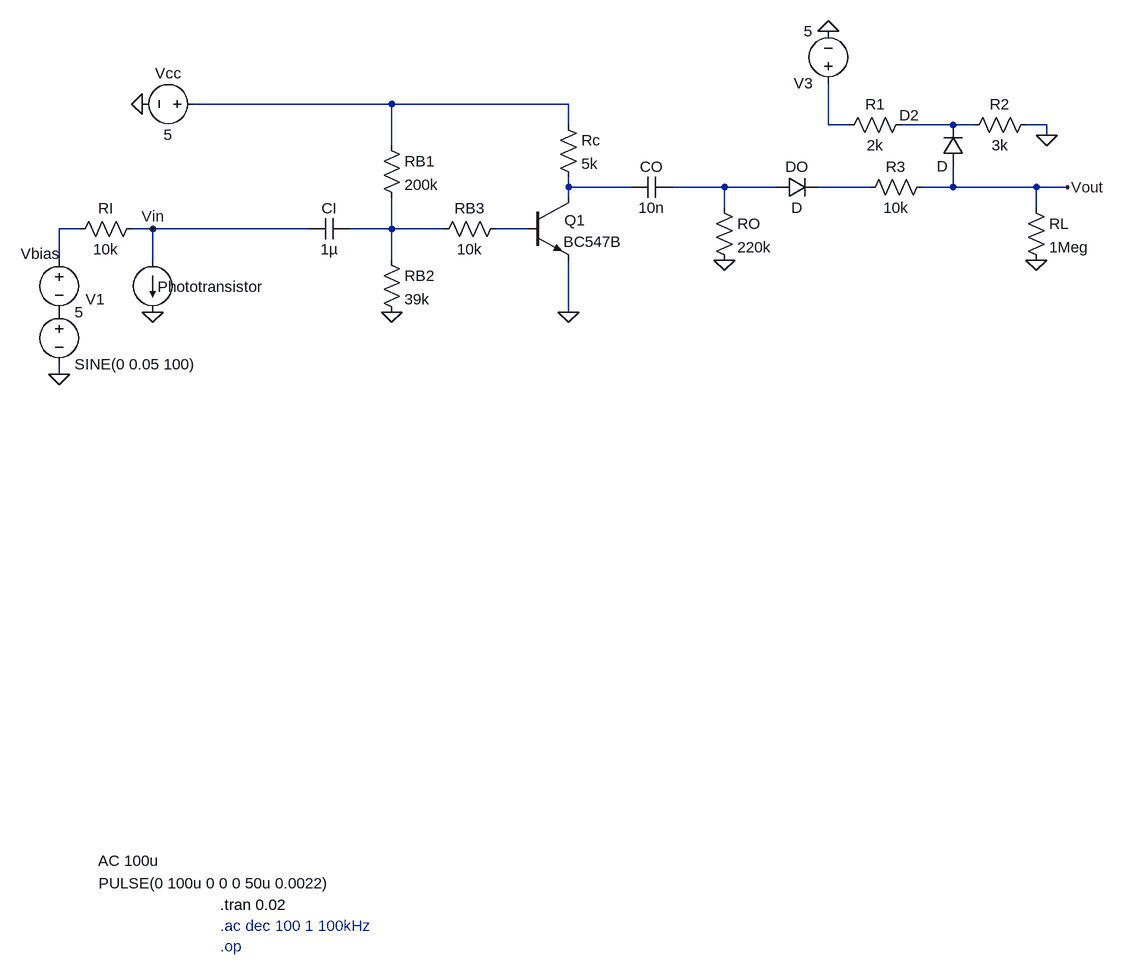
[diagram p0: schematic FinalInfrared.asc]
FinalInfrared.asc, the LTspice schematic file:
Version 4
SHEET 1 2344 1168
WIRE 496 -144 192 -144
WIRE 768 -144 496 -144
WIRE 768 -112 768 -144
WIRE 1168 -112 1168 -176
WIRE 1200 -112 1168 -112
WIRE 1360 -112 1280 -112
WIRE 1392 -112 1360 -112
WIRE 1504 -112 1472 -112
WIRE 1504 -96 1504 -112
WIRE 496 -80 496 -144
WIRE 768 -16 768 -32
WIRE 864 -16 768 -16
WIRE 1008 -16 928 -16
WIRE 1088 -16 1008 -16
WIRE 1232 -16 1152 -16
WIRE 1360 -16 1360 -48
WIRE 1360 -16 1312 -16
WIRE 1488 -16 1360 -16
WIRE 1536 -16 1488 -16
WIRE 768 0 768 -16
WIRE 1008 16 1008 -16
WIRE 1488 16 1488 -16
WIRE 16 48 -16 48
WIRE 128 48 96 48
WIRE 368 48 128 48
WIRE 496 48 496 0
WIRE 496 48 432 48
WIRE 576 48 496 48
WIRE 704 48 656 48
WIRE -16 96 -16 48
WIRE 128 96 128 48
WIRE 496 96 496 48
WIRE 768 176 768 96
WIRE -16 272 -16 256
FLAG 128 176 0
FLAG -16 272 0
FLAG 128 48 Vin
FLAG 768 176 0
FLAG 112 -144 0
FLAG 1008 96 0
FLAG 1168 -256 0
FLAG 1488 96 0
FLAG 1536 -16 Vout
FLAG 1504 -96 0
FLAG 496 176 0
SYMBOL current 128 96 R0
WINDOW 0 8 41 Left 2
WINDOW 123 -84 924 Left 2
WINDOW 39 0 0 Left 0
WINDOW 3 -83 959 Left 2
SYMATTR InstName Phototransistor
SYMATTR Value2 AC 100u
SYMATTR Value PULSE(0 100u 0 0 0 50u 0.0022)
SYMBOL voltage -16 80 R0
WINDOW 123 0 0 Left 0
WINDOW 39 0 0 Left 0
WINDOW 0 -59 6 Left 2
SYMATTR InstName Vbias
SYMATTR Value 5
SYMBOL res 112 32 R90
WINDOW 0 0 56 VBottom 2
WINDOW 3 32 56 VTop 2
SYMATTR InstName RI
SYMATTR Value 10k
SYMBOL res 480 -96 R0
SYMATTR InstName RB1
SYMATTR Value 200k
SYMBOL cap 432 32 R90
WINDOW 0 0 32 VBottom 2
WINDOW 3 32 32 VTop 2
SYMATTR InstName CI
SYMATTR Value 1µ
SYMBOL npn 704 0 R0
WINDOW 0 58 35 Left 2
SYMATTR InstName Q1
SYMATTR Value BC547B
SYMBOL res 752 -128 R0
SYMATTR InstName Rc
SYMATTR Value 5k
SYMBOL voltage 208 -144 R90
WINDOW 0 -32 56 VBottom 2
WINDOW 3 32 56 VTop 2
WINDOW 123 0 0 Left 0
WINDOW 39 0 0 Left 0
SYMATTR InstName Vcc
SYMATTR Value 5
SYMBOL res 672 32 R90
WINDOW 0 0 56 VBottom 2
WINDOW 3 32 56 VTop 2
SYMATTR InstName RB3
SYMATTR Value 10k
SYMBOL cap 928 -32 R90
WINDOW 0 0 32 VBottom 2
WINDOW 3 32 32 VTop 2
SYMATTR InstName CO
SYMATTR Value 10n
SYMBOL res 992 0 R0
SYMATTR InstName RO
SYMATTR Value 220k
SYMBOL res 1328 -32 R90
WINDOW 0 0 56 VBottom 2
WINDOW 3 32 56 VTop 2
SYMATTR InstName R3
SYMATTR Value 10k
SYMBOL diode 1376 -48 R180
WINDOW 0 68 79 Left 2
WINDOW 3 24 0 Left 2
SYMATTR InstName D2
SYMBOL res 1472 0 R0
SYMATTR InstName RL
SYMATTR Value 1Meg
SYMBOL voltage 1168 -160 R180
WINDOW 123 0 0 Left 0
WINDOW 39 0 0 Left 0
SYMATTR InstName V3
SYMATTR Value 5
SYMBOL res 1488 -128 R90
WINDOW 0 0 56 VBottom 2
WINDOW 3 32 56 VTop 2
SYMATTR InstName R2
SYMATTR Value 3k
SYMBOL res 1296 -128 R90
WINDOW 0 0 56 VBottom 2
WINDOW 3 32 56 VTop 2
SYMATTR InstName R1
SYMATTR Value 2k
SYMBOL diode 1088 0 R270
WINDOW 0 32 32 VTop 2
WINDOW 3 0 32 VBottom 2
SYMATTR InstName DO
SYMBOL res 480 80 R0
SYMATTR InstName RB2
SYMATTR Value 39k
SYMBOL voltage -16 160 R0
WINDOW 123 0 0 Left 0
WINDOW 39 0 0 Left 0
WINDOW 0 41 -4 Left 2
SYMATTR InstName V1
SYMATTR Value SINE(0 0.05 100)
TEXT 232 1088 Left 2 !.tran 0.02
TEXT 232 1120 Left 2 ;.ac dec 100 1 100kHz
TEXT 232 1152 Left 2 ;.op

The netlist it stands for:
* FinalInfrared.asc
I§Phototransistor Vin 0 PULSE(0 100u 0 0 0 50u 0.0022) AC 100u
Vbias N007 P001 5
RI Vin N007 10k
RB1 N001 N008 200k
CI N008 Vin 1µ
Q1 N004 N009 0 0 BC547B
Rc N001 N004 5k
Vcc N001 0 5
RB3 N009 N008 10k
CO N005 N004 10n
RO N005 0 220k
R3 Vout N006 10k
D2 Vout N003 D
RL Vout 0 1Meg
V3 N002 0 5
R2 0 N003 3k
R1 N003 N002 2k
DO N005 N006 D
RB2 N008 0 39k
V1 P001 0 SINE(0 0.05 100)
.model D D
.lib standard.dio
.model NPN NPN
.model PNP PNP
.lib standard.bjt
.tran 0.02
* .ac dec 100 1 100kHz
* .op
.backanno
.end